# EAGLE design ENC28J60 LAN RFID PCB (EAGLE 9.5.2)
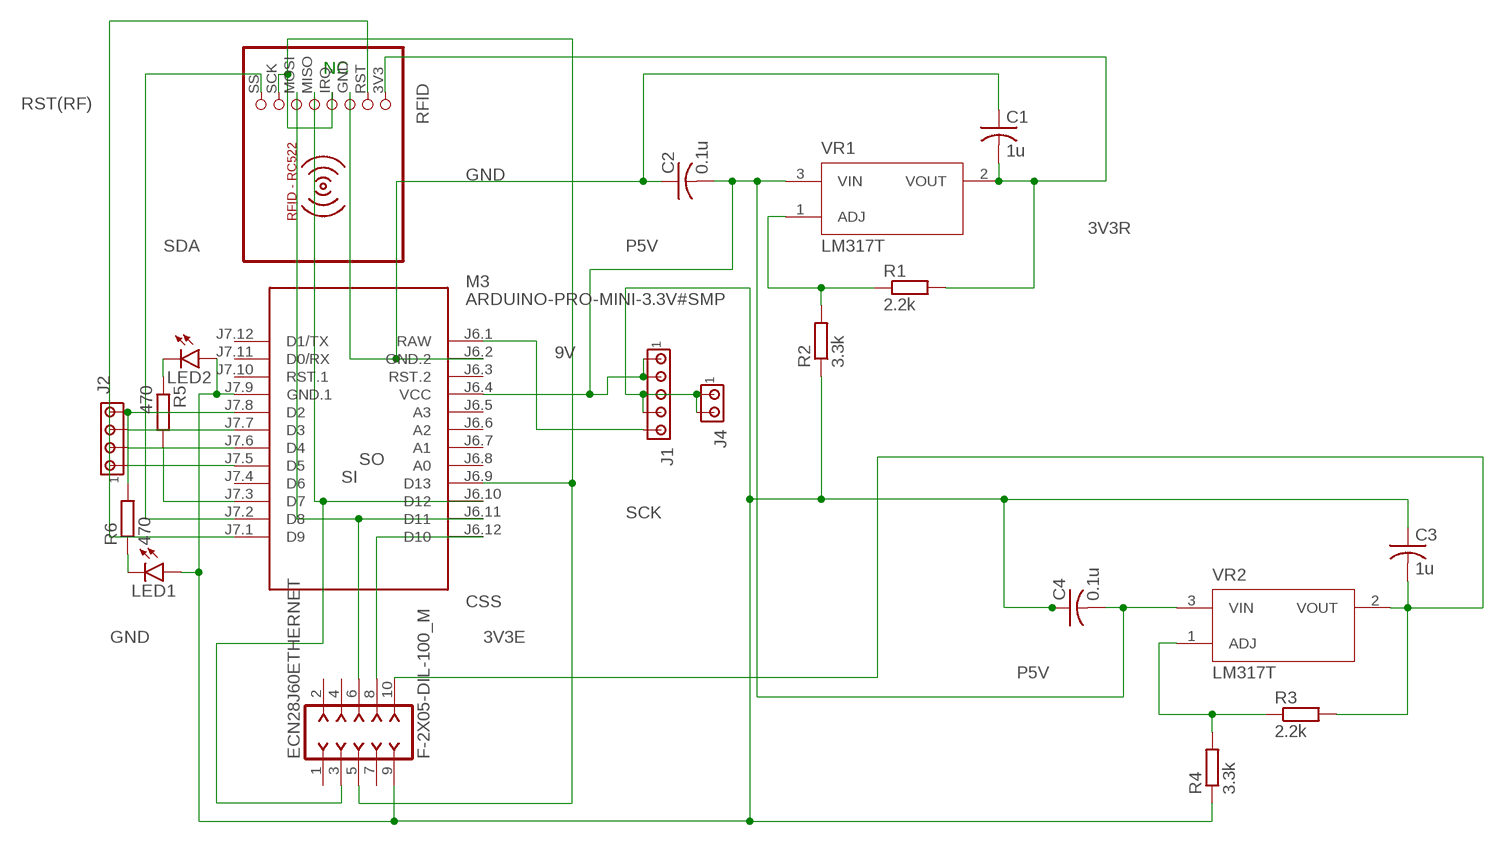
[diagram p0: schematic, sheet 1]

## Parts
C1  1u  C-US025-025X050  [C025-025X050]
C2  0.1u  C-US025-025X050  [C025-025X050]
C3  1u  C-US025-025X050  [C025-025X050]
C4  0.1u  C-US025-025X050  [C025-025X050]
ECN28J60ETHERNET  F-2X05-DIL-100_M  [DIL-100-2X05_M]
J1  MTA05-100  [10X05MTA]
J2  MTA04-100  [10X04MTA]
J4  MTA02-100  [10X02MTA]
LED1  LED3MM  [LED3MM]
LED2  LED3MM  [LED3MM]
M3  ARDUINO-PRO-MINI-3.3V#SMP  [ARDUINO-PRO-MINI#SMP]
R1  2.2k  R-EU_0207/10  [0207/10]
R2  3.3k  R-EU_0207/10  [0207/10]
R3  2.2k  R-EU_0207/10  [0207/10]
R4  3.3k  R-EU_0207/10  [0207/10]
R5  470  R-EU_0207/10  [0207/10]
R6  470  R-EU_0207/10  [0207/10]
RFID  RFID-RC522  [RFID-RC522]
VR1  LM317T  [TO254P1054X470X1955-3]
VR2  LM317T  [TO254P1054X470X1955-3]

## Nets
3V3E: C3.2 ECN28J60ETHERNET.10 R3.2 VR2.2(VOUT)
3V3R: C1.2 R1.2 RFID.3V3 VR1.2(VOUT)
9V: J1.5 M3.J6.1(RAW)
CSS: ECN28J60ETHERNET.8 M3.J6.12(D10)
GND: C1.1 C2.1 C3.1 C4.1 ECN28J60ETHERNET.9 J1.3 J1.4 J4.1 J4.2 LED1.A LED2.A M3.J6.2(GND.2) M3.J7.9(GND.1) R2.1 R4.1 RFID.GND
N$1: R1.1 R2.2 VR1.1(ADJ)
N$2: R3.1 R4.2 VR2.1(ADJ)
N$3: M3.J7.3(D7) R5.2
N$4: LED2.K(C) R5.1
N$5: J2.4 M3.J7.8(D2) R6.2
N$6: J2.3 M3.J7.7(D3)
N$7: J2.2 M3.J7.6(D4)
N$8: J2.1 M3.J7.5(D5)
N$9: LED1.K(C) R6.1
P5V: C2.2 C4.2 J1.1 J1.2 M3.J6.4(VCC) VR1.3(VIN) VR2.3(VIN)
RST(RF): M3.J7.1(D9) RFID.RST
SCK: ECN28J60ETHERNET.5 M3.J6.9(D13) RFID.IRQ RFID.SCK
SDA: M3.J7.2(D8) RFID.SS
SI: ECN28J60ETHERNET.6 M3.J6.11(D11) RFID.MOSI
SO: ECN28J60ETHERNET.3 M3.J6.10(D12) RFID.MISO
Unconnected: ECN28J60ETHERNET.1 ECN28J60ETHERNET.2 ECN28J60ETHERNET.4 ECN28J60ETHERNET.7 M3.J6.3(RST.2) M3.J6.5(A3) M3.J6.6(A2) M3.J6.7(A1) M3.J6.8(A0) M3.J7.4(D6) M3.J7.10(RST.1) M3.J7.11(D0/RX) M3.J7.12(D1/TX)

## Notes on the sheet
- NC

## Library data of the parts
C1-C4 = rcl:C-US: CAPACITOR, American symbol; SPICEPREFIX: C
ECN28J60ETHERNET = con-headers-jp:F-2X05-: FEMALE HEADER
J1 = con-amp:MTA05-100: AMP connector
J2 = con-amp:MTA04-100: AMP connector
J4 = con-amp:MTA02-100: AMP connector
LED1 LED2 = led:LED: LED OSRAM: - CHIPLED LG R971, LG N971, LY N971, LG Q971, LY Q971, LO R971, LY R971 LH N974, LH R974 LS Q976, LO Q976, LY Q976 LO Q996 - Hyper CHIPLED LW Q18S LB Q993, LB Q99A, LB R99A - SideLED LS A670, LO A670, LY A670, LG A670, LP A670 LB A673, LV A673, LT A673, LW A673 LH A674 LY A675 LS A676, LA A676, LO A676, LY A676, LW A676 LS A679, LY A679, LG A679 - Hyper Micro SIDELED® LS Y876, LA Y876, LO Y876, LY Y876 LT Y87S - SmartLED LW L88C, LW L88S LB L89C, LB L89S, LG L890 LS L89K, LO L89K, LY L89K LS L896, LA L896, LO L896, LY L896 - TOPLED LS T670, LO T670, LY T670, LG T670, LP T670 LSG T670, LSP T670, LSY T670, LOP T670, LYG T670 LG T671, LOG T671, LSG T671 LB T673, LV T673, LT T673, LW T673 LH T674 LS T676, LA T676, LO T676, LY T676, LB T676, LH T676, LSB T676, LW T676 LB T67C, LV T67C, LT T67C, LS T67K, LO T67K, LY T67K, LW E67C LS E67B, LA E67B, LO E67B, LY E67B, LB E67C, LV E67C, LT E67C LW T67C LS T679, LY T679, LG T679 LS T770, LO T770, LY T770, LG T770, LP T770 LB T773, LV T773, LT T773, LW T773 LH T774 LS E675, LA E675, LY E675, LS T675 LS T776, LA T776, LO T776, LY T776, LB T776 LHGB T686 LT T68C, LB T68C - Hyper Mini TOPLED® LB M676 - Mini TOPLED Santana® LG M470 LS M47K, LO M47K, LY M47K Source: http://www.osram.convergy.de LUXEON: - LUMILED® LXK2-PW12-R00, LXK2-PW12-S00, LXK2-PW14-U00, LXK2-PW14-V00 LXK2-PM12-R00, LXK2-PM12-S00, LXK2-PM14-U00 LXK2-PE12-Q00, LXK2-PE12-R00, LXK2-PE12-S00, LXK2-PE14-T00, LXK2-PE14-U00 LXK2-PB12-K00, LXK2-PB12-L00, LXK2-PB12-M00, LXK2-PB14-N00, LXK2-PB14-P00, LXK2-PB14-Q00 LXK2-PR12-L00, LXK2-PR12-M00, LXK2-PR14-Q00, LXK2-PR14-R00 LXK2-PD12-Q00, LXK2-PD12-R00, LXK2-PD12-S00 LXK2-PH12-R00, LXK2-PH12-S00 LXK2-PL12-P00, LXK2-PL12-Q00, LXK2-PL12-R00 Source: www.luxeon.com KINGBRIGHT: KA-3528ASYC Source: www.kingbright.com
M3 = diy-modules:ARDUINO-PRO-MINI-*#SMP: Arduino Pro Mini (and compatible devices) with 2 connectors only More details available here: https://www.arduino.cc/en/Main/ArduinoBoardProMini Click here to find device on ebay.com <http://www.ebay.com/sch/arduino+pro+mini>
R1-R6 = rcl:R-EU_: RESISTOR, European symbol; SPICEPREFIX: R
RFID = mfrc522-module:RFID-RC522: RFID-RC522 MFRC-522 based breakout board
VR1 VR2 = LM317T:LM317T: Standard Regulator Pos 1.2V to 37V 0.4A 3-Pin(3+Tab) TO-220 Rail; AVAILABILITY: Unavailable; DESCRIPTION: Standard Regulator Pos 1.2V to 37V 0.4A 3-Pin_3+Tab_ TO-220 Rail; MF: Texas Instruments; MP: LM317T; PACKAGE: TO-220-3 HTC Korea; PRICE: None

## Board
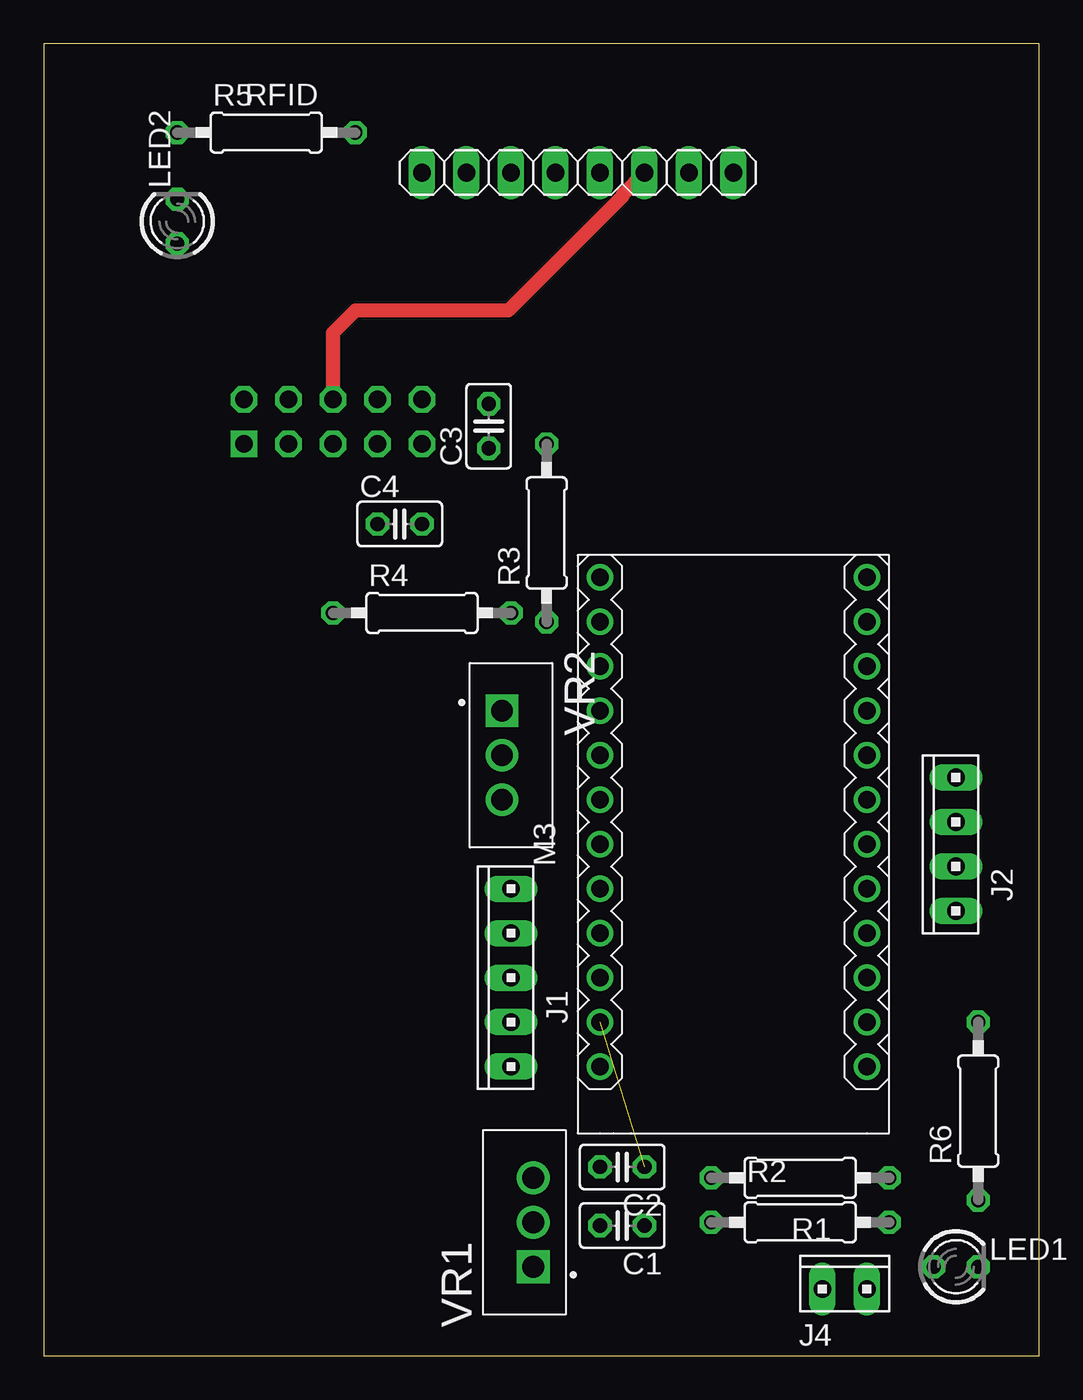
[diagram p1: board, top side]
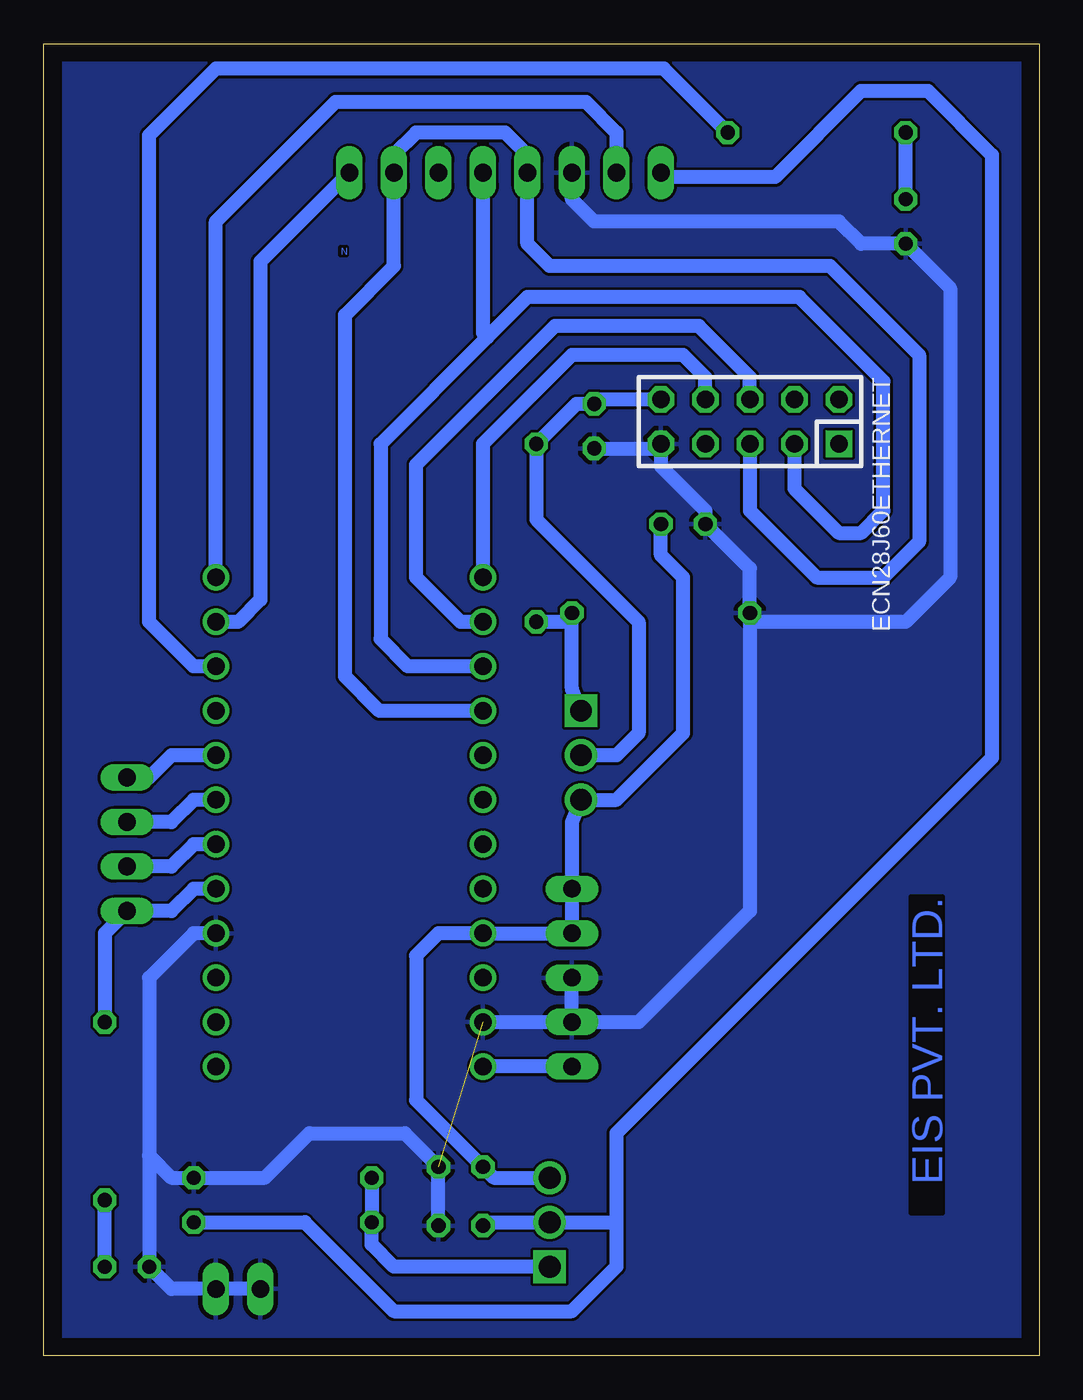
[diagram p2: board, bottom side, seen from below]

Size 56.82 x 74.92 mm. Coordinates in mm from the lower left corner, seen from the top.
Outline: 0,0 56.82,0 56.82,74.92 0,74.92 0,0
Copper layers (1*16): Top 0.035mm / dielectric 1.5mm / Bottom 0.035mm
Design rules "default": minimum track width 6mil, minimum drill 0.35mm, track to track 6mil, track to pad 6mil, pad to pad 6mil, via to via 6mil, smd to smd 6mil, copper to edge 40mil, drill to drill 6mil, minimum pad ring 10mil, minimum via ring 8mil, stop-mask expansion 4mil, vias tented up to drill 0mil, thermal gap 10mil

### Footprints (pad centres in the part's own frame; a part is rotated, then mirrored left to right if it is on the bottom)
C025-025X050 = drill 0.813 octagon: 1 -1.27,0; 2 1.27,0
DIL-100-2X05_M = drill 1.016 square: 1 -5.08,1.27 | drill 1.016 octagon: 2 -5.08,-1.27; 3 -2.54,1.27; 4 -2.54,-1.27; 5 0,1.27; 6 0,-1.27; 7 2.54,1.27; 8 2.54,-1.27; 9 5.08,1.27; 10 5.08,-1.27
10X05MTA = drill 1.016 long: 1 5.08,0; 2 2.54,0; 3 0,0; 4 -2.54,0; 5 -5.08,0
10X04MTA = drill 1.016 long: 1 3.81,0; 2 1.27,0; 3 -1.27,0; 4 -3.81,0
10X02MTA = drill 1.016 long: 1 1.27,0; 2 -1.27,0
LED3MM = drill 0.813 octagon: A -1.27,0; K 1.27,0
ARDUINO-PRO-MINI#SMP = drill 1: J6.1 -12.7,7.62; J6.2 -10.16,7.62; J6.3 -7.62,7.62; J6.4 -5.08,7.62; J6.5 -2.54,7.62; J6.6 0,7.62; J6.7 2.54,7.62; J6.8 5.08,7.62; J6.9 7.62,7.62; J6.10 10.16,7.62; J6.11 12.7,7.62; J6.12 15.24,7.62; J7.1 15.24,-7.62; J7.2 12.7,-7.62; J7.3 10.16,-7.62; J7.4 7.62,-7.62; J7.5 5.08,-7.62; J7.6 2.54,-7.62; J7.7 0,-7.62; J7.8 -2.54,-7.62; J7.9 -5.08,-7.62; J7.10 -7.62,-7.62; J7.11 -10.16,-7.62; J7.12 -12.7,-7.62
0207/10 = drill 0.813 octagon: 1 -5.08,0; 2 5.08,0
RFID-RC522 = drill 1.016 long: 3V3 -8.89,0; GND -3.81,0; IRQ -1.27,0; MISO 1.27,0; MOSI 3.81,0; RST -6.35,0; SCK 6.35,0; SS 8.89,0
TO254P1054X470X1955-3 = drill 1.24 pad 1.86 square: 1 -2.54,-0.51 | drill 1.24 pad 1.86: 2 0,-0.51; 3 2.54,-0.51

### Placement (x,y rotation side)
C1  33.02,7.43 180 top
C2  33.02,10.78 180 top
C3  25.4,53.09 90 top
C4  20.32,47.5 0 top
ECN28J60ETHERNET  16.51,53.34 180 bottom
J1  26.67,21.59 90 top
J2  52.07,29.21 90 top
J4  45.72,3.81 0 top
LED1  52.07,5.08 0 top
LED2  7.62,64.77 90 top
M3  39.37,29.21 90 top
R1  43.18,7.62 0 top
R2  43.18,10.16 180 top
R3  28.7,46.99 90 top
R4  21.59,42.42 0 top
R5  12.7,69.85 0 top
R6  53.34,13.97 90 top
RFID  30.48,67.56 0 top
VR1  27.43,7.62 90 top
VR2  26.67,34.29 270 top

### Tracks (layer width: path | path; a pad name or v marks a point on that pad's centre or on a via)
3V3E
  Bottom 0.813: ECN28J60ETHERNET.10 25.15,54.61 C3.2 26.42,54.36 R3.2 28.7,47.75 22.86,41.91 22.86,35.56 24.13,34.29 VR2.2
3V3R
  Bottom 0.813: RFID.3V3 21.34,67.31 15.08,67.31 10.16,72.23 6.35,72.23 2.69,68.57 2.69,34.14 24.13,12.7 24.13,7.62 | R1.2 41.91,7.62 36.83,2.54 26.67,2.54 24.13,5.08 24.13,7.62 | C1.2 31.56,7.62 VR1.2 24.13,7.62
9V
  Bottom 0.813: J1.5 M3.J6.1
CSS
  Bottom 0.813: ECN28J60ETHERNET.8 19.05,55.88 20.32,57.15 26.67,57.15 31.75,52.07 M3.J6.12
GND  (1 unrouted)
  Bottom 0.813: 50.8,11.43 49.53,10.16 R2.1 44.2,10.16 41.66,12.7 36.21,12.7 C2.1 C1.1 | RFID.GND 26.67,66.04 25.4,64.77 11.43,64.77 10.16,63.5 LED2.A 5.08,60.96 5.08,44.45 7.62,41.91 16,41.91 R4.1 | M3.J6.2 J1.4 | J1.4 22.86,19.05 16.51,25.4 R4.1 | J1.4 J1.3 | R4.1 16.51,44.96 C4.1 19.05,48.26 21.59,50.8 ECN28J60ETHERNET.9 21.84,51.82 C3.1 | M3.J7.9 48.26,24.13 50.8,21.59 50.8,11.43 | 50.8,11.43 LED1.A 49.53,3.81 J4.1 J4.2
  pour Bottom: 0,74.93 55.88,74.93 55.88,0 0,0
N$1
  Bottom 0.813: R2.2 R1.1 38.1,6.35 36.83,5.08 VR1.1
N$2
  Bottom 0.813: R3.1 27.18,41.91 R4.2 26.67,38.1 VR2.1
N$3
  Bottom 0.813: R5.2 21.43,73.5 46.99,73.5 50.8,69.69 50.8,41.91 48.26,39.37 M3.J7.3
N$4
  Bottom 0.813: LED2.K R5.1
N$5
  Bottom 0.813: M3.J7.8 48.26,26.67 49.53,25.4 J2.4 53.34,24.13 R6.2
N$6
  Bottom 0.813: M3.J7.7 48.26,29.21 49.53,27.94 J2.3
N$7
  Bottom 0.813: M3.J7.6 48.26,31.75 49.53,30.48 J2.2
N$8
  Bottom 0.813: J2.1 50.8,33.02 49.53,34.29 M3.J7.5
N$9
  Bottom 0.813: LED1.K R6.1
P5V
  Bottom 0.813: C4.2 21.59,45.72 20.32,44.45 20.32,35.56 24.13,31.75 VR2.3 26.67,30.48 J1.1 J1.2 M3.J6.4 34.29,24.13 35.56,22.86 35.56,14.59 C2.2 31.13,10.16 VR1.3
RST(RF)
  Bottom 0.813: RFID.RST 24.13,69.85 25.88,71.6 40.16,71.6 46.99,64.77 M3.J7.1
SCK
  Bottom 0.813: M3.J6.9 37.67,36.83 39.62,38.79 39.62,59.44 36.83,62.23 RFID.SCK 36.83,68.58 35.56,69.85 30.48,69.85 29.21,68.58 RFID.IRQ 29.21,63.5 27.94,62.23 11.94,62.23 6.86,57.15 6.86,46.48 8.89,44.45 12.7,44.45 16.51,48.26 ECN28J60ETHERNET.5
SDA
  Bottom 0.813: RFID.SS 44.45,62.48 44.45,43.18 45.72,41.91 M3.J7.2
SI
  Top 0.813: ECN28J60ETHERNET.6 16.51,58.42 17.78,59.69 26.51,59.69 33.07,66.25 33.07,66.34 RFID.MOSI
  Bottom 0.813: M3.J6.11 33.02,41.91 35.56,44.45 35.56,50.88 27.64,58.8 19.43,58.8 16.51,55.88 ECN28J60ETHERNET.6
SO
  Bottom 0.813: M3.J6.10 36.03,39.37 37.59,40.93 37.59,52.07 31.5,58.17 | 31.5,58.17 29.21,60.45 13.69,60.45 8.89,55.65 8.89,48.26 10.16,46.99 11.43,46.99 13.97,49.53 ECN28J60ETHERNET.3 | RFID.MISO 31.75,58.42 31.5,58.17

### Text on the board
Bottom: N | EIS PVT. LTD.